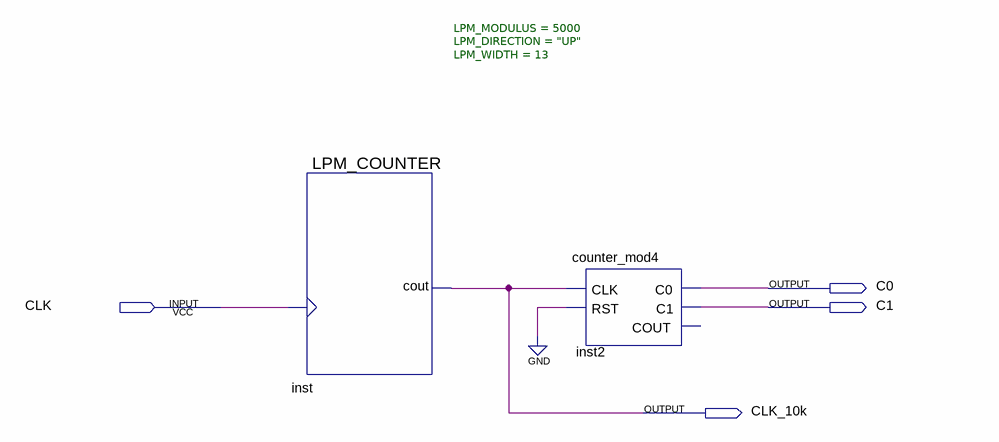
[diagram p0: schematic sheet]
// Quartus schematic seven_seg_selector_10khz.bdf as structural Verilog: 2 symbols, 4 pins
module seven_seg_selector_10khz (
  input  CLK,
  output C0,
  output C1,
  output CLK_10k
);

  LPM_COUNTER #(.LPM_MODULUS(5000), .LPM_DIRECTION("UP"), .LPM_WIDTH(13)) inst (.clock(CLK), .cout(CLK_10k));
  counter_mod4 inst2 (.CLK(CLK_10k), .RST(1'b0), .C0(C0), .C1(C1));  // open: COUT
endmodule
